# Altium schematic sheet CW308T_XMEGA_MICRO.SchDoc: XMEGA Microcontroller
size Letter; Organization: NewAE Technology Inc.; Address1: 1083 Queen St., Suite 196; Address2: Halifax; Address3: NS; Address4: Canada B3H 0B2; SheetNumber: 1; SheetTotal: 2; SheetApproved: YES
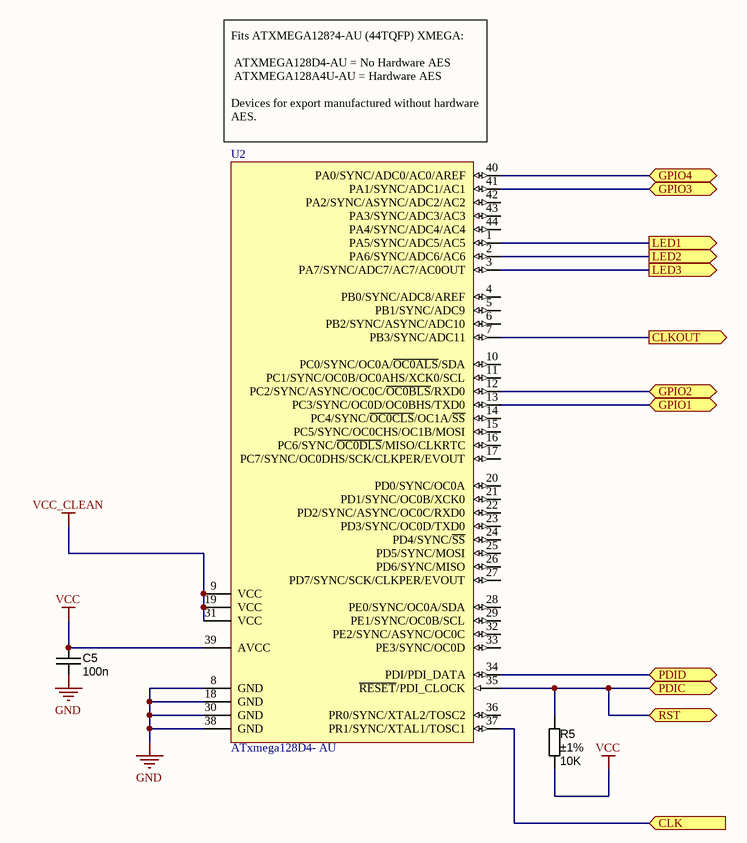
[diagram p0: CW308T_XMEGA_MICRO.SchDoc]

## Parts
C5  value 100n  [CAPC1608X90N]  (hidden comment: approved sub OK)
R5  value 10K  Tolerance: ±1%  [RESC1608X55N]  (hidden comment: Thick Film)
U2  ATxmega128D4- AU  [44A_M]

## Ports
CLK (in), CLKOUT (out), GPIO1 (bidir), GPIO2 (bidir), GPIO3 (bidir), GPIO4 (bidir), LED1 (out), LED2 (out), LED3 (out), PDIC (bidir), PDID (bidir), RST (bidir)

## Nets
GND: C5.2 U2.8(GND) U2.18(GND) U2.30(GND) U2.38(GND)
VCC: C5.1 R5.1 U2.39(AVCC)
VCC_CLEAN: U2.9(VCC) U2.19(VCC) U2.31(VCC)
CLK: U2.37(PR1/SYNC/XTAL1/TOSC1) ; port CLK
CLKOUT: U2.7(PB3/SYNC/ADC11) ; port CLKOUT
GPIO1: U2.13(PC3/SYNC/OC0D/OC0BHS/TXD0) ; port GPIO1
GPIO2: U2.12(PC2/SYNC/ASYNC/OC0C/~{OC0BLS}/RXD0) ; port GPIO2
GPIO3: U2.41(PA1/SYNC/ADC1/AC1) ; port GPIO3
GPIO4: U2.40(PA0/SYNC/ADC0/AC0/AREF) ; port GPIO4
LED1: U2.1(PA5/SYNC/ADC5/AC5) ; port LED1
LED2: U2.2(PA6/SYNC/ADC6/AC6) ; port LED2
LED3: U2.3(PA7/SYNC/ADC7/AC7/AC0OUT) ; port LED3
PDIC: R5.2 U2.35(~{RESET}/PDI_CLOCK) ; port PDIC, port RST
PDID: U2.34(PDI/PDI_DATA) ; port PDID

Not connected (* = marked no-connect by the designer): U2 4(PB0/SYNC/ADC8/AREF) 5(PB1/SYNC/ADC9) 6(PB2/SYNC/ASYNC/ADC10) 10(PC0/SYNC/OC0A/~{OC0ALS}/SDA) 11(PC1/SYNC/OC0B/OC0AHS/XCK0/SCL) 14(PC4/SYNC/~{OC0CLS}/OC1A/~{SS}) 15(PC5/SYNC/OC0CHS/OC1B/MOSI) 16(PC6/SYNC/~{OC0DLS}/MISO/CLKRTC) 17(PC7/SYNC/OC0DHS/SCK/CLKPER/EVOUT) 20(PD0/SYNC/OC0A) 21(PD1/SYNC/OC0B/XCK0) 22(PD2/SYNC/ASYNC/OC0C/RXD0) 23(PD3/SYNC/OC0D/TXD0) 24(PD4/SYNC/~{SS}) 25(PD5/SYNC/MOSI) 26(PD6/SYNC/MISO) 27(PD7/SYNC/SCK/CLKPER/EVOUT) 28(PE0/SYNC/OC0A/SDA) 29(PE1/SYNC/OC0B/SCL) 32(PE2/SYNC/ASYNC/OC0C) 33(PE3/SYNC/OC0D) 36(PR0/SYNC/XTAL2/TOSC2) 42(PA2/SYNC/ASYNC/ADC2/AC2) 43(PA3/SYNC/ADC3/AC3) 44(PA4/SYNC/ADC4/AC4)

## Notes on the sheet
- (near U2) Fits ATXMEGA128?4-AU (44TQFP) XMEGA:
  ATXMEGA128D4-AU = No Hardware AES
  ATXMEGA128A4U-AU = Hardware AES
  Devices for export manufactured without hardware AES.
- Title:
- Date:
- Rev:
- Time:
- Project:
- Sheet
- of
- License:
- Copyright © NewAE Technology Inc.
- Approved:
- NewAE.com
- File:

## Library data of the parts
C5 = CAPC_100n_0603_X7R_50V_10%: Capacitor SMD Cer 100nF 10% 50V X7R 0603; Manufacturer 1: AVX Corporation; Manufacturer Part Number 1: 06035C104KAT2A; Ratings: 50V; X7R; Material: ceramic; SCDType: spec; Manufacturer 2: TDK Corporation; Manufacturer Part Number 2: C1608X7R1H104K; Package / Case: 0603 (1608 Metric); Tolerance: ±10%; Supplier 1: Digi-Key; Supplier Part Number 1: 478-5052-1-ND; ComponentLink1URL: http://www.avx.com/docs/Catalogs/cx7r.pdf; ComponentLink1Description: http://www.avx.com/docs/Catalogs/cx7r.pdf; Supplier 2: Digi-Key; Supplier Part Number 2: 445-1314-1-ND; ComponentLink2URL: http://product.tdk.com/capacitor/mlcc/en/documents/mlcc_commercial_general_en.pdf; ComponentLink2Description: http://product.tdk.com/capacitor/mlcc/en/documents/mlcc_commercial_general_en.pdf
R5 = RES_10K_0603_1%: Resistor SMD chip 10k Ohm 0.1W 1% 0603; Manufacturer 1: Yageo; Manufacturer Part Number 1: RC0603FR-0710KL; Ratings: 1/10W; SCDType: spec; Package / Case: 0603 (1608 Metric); Supplier 1: Digi-Key; Supplier Part Number 1: 311-10.0KHRCT-ND
U2 = CMP-0094-00044-3: 8/16-bit AVR XMEGA D4 Microcontroller, 1.6-3.6V, 32MHz, 128KB + 8KB Flash, 2KB EEPROM, 8KB SRAM, 44-pin TQFP, Industrial Grade (-40°C to 85°C), Pb-Free; Manufacturer: Atmel; ComponentLink2URL: http://www.atmel.com/Images/Atmel-8135-8-and-16-bit-AVR-microcontroller-ATxmega16D4-32D4-64D4-128D4_datasheet.pdf; RevisionNote: update URL version and symbol Pin7,10,12,14,16,17,27,35,36,37æ”¹åŠ¨; PartNumber: ATxmega128D4- AU; DatasheetVersion: revP, Jan-2014; Code_JEDEC: MS-026-ACB; PackageDescription: 44-Pin Plastic Thin Profile Quad Flat Pack, 10 x 10 x 1.0 mm Body, 0.8 mm Pitch (TQFP); PackageVersion: revC, Oct-2010; ComponentLink1Description: Manufacturer URL; PackageReference: 44A; ComponentLink1URL: http://www.atmel.com/; ComponentLink2Description: Datasheet